# Altium schematic sheet 11.SchDoc
size 420 x 297 mm
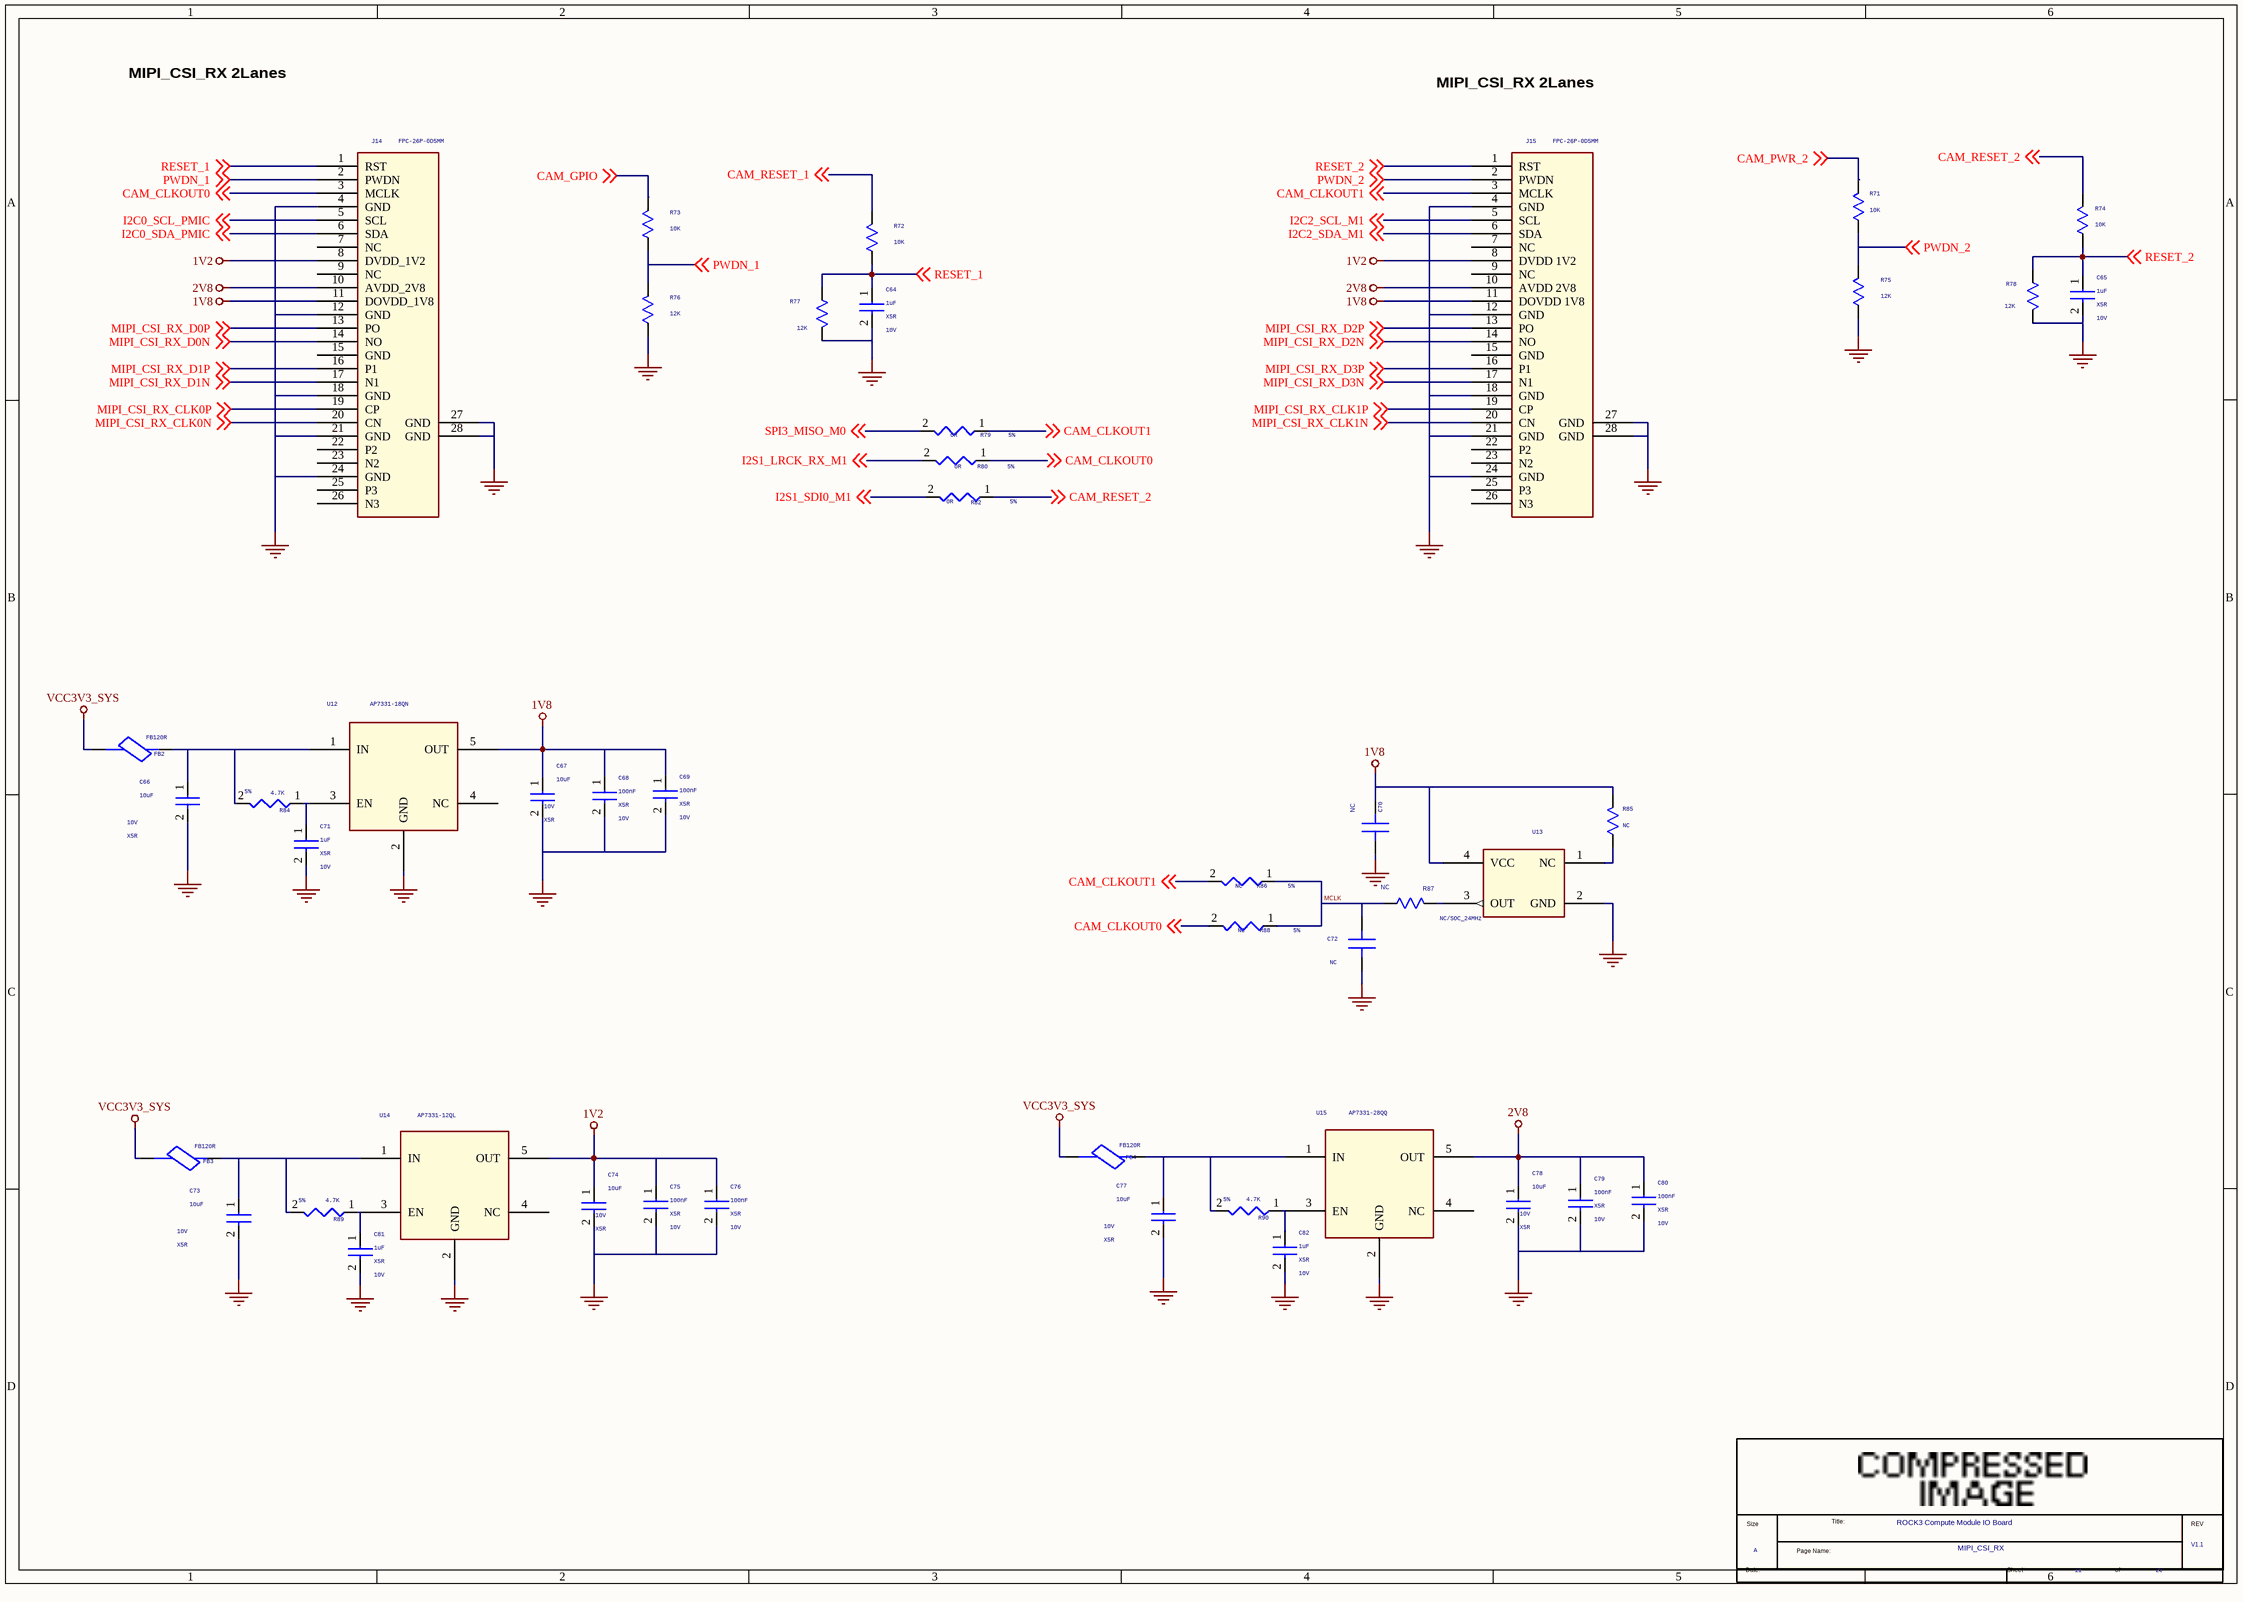
[diagram p0: 11.SchDoc]

## Parts
*  Page Count: 20  Page Number: 11  Page Size: A  Title: ROCK3 Compute Module IO Board  RevCode: V1.1  Doc: MIPI_CSI_RX  (hidden comment: radxa_gong)  (graphical)
C64  1uF  Voltage: 10V  Dielectric: X5R  [C0402]
C65  1uF  Voltage: 10V  Dielectric: X5R  [C0402]
C66  10uF  Voltage: 10V  Dielectric: X5R  [C0603]
C67  10uF  Voltage: 10V  Dielectric: X5R  [C0603]
C68  100nF  Voltage: 10V  Dielectric: X5R  [C0402]
C69  100nF  Voltage: 10V  Dielectric: X5R  [C0402]
C70  NC  [C0402]
C71  1uF  Voltage: 10V  Dielectric: X5R  [C0402]
C72  NC  [C0402]
C73  10uF  Voltage: 10V  Dielectric: X5R  [C0603]
C74  10uF  Voltage: 10V  Dielectric: X5R  [C0603]
C75  100nF  Voltage: 10V  Dielectric: X5R  [C0402]
C76  100nF  Voltage: 10V  Dielectric: X5R  [C0402]
C77  10uF  Voltage: 10V  Dielectric: X5R  [C0603]
C78  10uF  Voltage: 10V  Dielectric: X5R  [C0603]
C79  100nF  Voltage: 10V  Dielectric: X5R  [C0402]
C80  100nF  Voltage: 10V  Dielectric: X5R  [C0402]
C81  1uF  Voltage: 10V  Dielectric: X5R  [C0402]
C82  1uF  Voltage: 10V  Dielectric: X5R  [C0402]
FB2  FB120R  [R0402]
FB3  FB120R  [R0402]
FB4  FB120R  [R0402]
J14  FPC-26P-0D5MM  [com40pin_0_5]
J15  FPC-26P-0D5MM  [com40pin_0_5]
R71  10K  [R0402]
R72  10K  [R0402]
R73  10K  [R0402]
R74  10K  [R0402]
R75  12K  [R0402]
R76  12K  [R0402]
R77  12K  [R0402]
R78  12K  [R0402]
R79  0R  Tolerance: 5%  [R0402]
R80  0R  Tolerance: 5%  [R0402]
R82  0R  Tolerance: 5%  [R0402]
R84  4.7K  Tolerance: 5%  [R0402]
R85  NC  [R0402]
R86  NC  Tolerance: 5%  [R0402]
R87  NC  [R0402]
R88  NC  Tolerance: 5%  [R0402]
R89  4.7K  Tolerance: 5%  [R0402]
R90  4.7K  Tolerance: 5%  [R0402]
U12  AP7331-18QN  [SOT25]
U13  NC/SOC_24MHz  [CRY4_3R20X2R50X0R80]
U14  AP7331-12QL  [SOT25]
U15  AP7331-28QQ  [SOT25]

## Nets
1V2: C74.1 C75.1 C76.1 J14.8(DVDD_1V2) J15.8(DVDD_1V2) U14.5(OUT)
1V8: C67.1 C68.1 C69.1 C70.1 J14.11(DOVDD_1V8) J15.11(DOVDD_1V8) R85.2 U12.5(OUT) U13.4(VCC)
2V8: C78.1 C79.1 C80.1 J14.10(AVDD_2V8) J15.10(AVDD_2V8) U15.5(OUT)
GND: C64.2 C65.2 C66.2 C67.2 C68.2 C69.2 C70.2 C71.2 C72.2 C73.2 C74.2 C75.2 C76.2 C77.2 C78.2 C79.2 C80.2 C81.2 C82.2 J14.4(GND) J14.12(GND) J14.18(GND) J14.21(GND) J14.24(GND) J14.27(GND) J14.28(GND) J15.4(GND) J15.12(GND) J15.18(GND) J15.21(GND) J15.24(GND) J15.27(GND) J15.28(GND) R75.1 R76.1 R77.1 R78.1 U12.2(GND) U13.2(GND) U14.2(GND) U15.2(GND)
VCC3V3_SYS: FB2.1 FB3.1 FB4.1
CAM_CLKOUT0: J14.3(MCLK) R80.1 R88.2 ; off-sheet CAM_CLKOUT0
CAM_CLKOUT1: J15.3(MCLK) R79.1 R86.2 ; off-sheet CAM_CLKOUT1
CAM_GPIO: R73.2 ; off-sheet CAM_GPIO
CAM_PWR_2: R71.2 ; off-sheet CAM_PWR_2
CAM_RESET_1: R72.2 ; off-sheet CAM_RESET_1
CAM_RESET_2: R74.2 R82.1 ; off-sheet CAM_RESET_2
I2C0_SCL_PMIC: J14.5(SCL) ; off-sheet I2C0_SCL_PMIC
I2C0_SDA_PMIC: J14.6(SDA) ; off-sheet I2C0_SDA_PMIC
I2C2_SCL_M1: J15.5(SCL) ; off-sheet I2C2_SCL_M1
I2C2_SDA_M1: J15.6(SDA) ; off-sheet I2C2_SDA_M1
I2S1_LRCK_RX_M1: R80.2 ; off-sheet I2S1_LRCK_RX_M1
I2S1_SDI0_M1: R82.2 ; off-sheet I2S1_SDI0_M1
MCLK: C72.1 R86.1 R87.2 R88.1
MIPI_CSI_RX_CLK0N: J14.20(CN) ; off-sheet MIPI_CSI_RX_CLK0N
MIPI_CSI_RX_CLK0P: J14.19(CP) ; off-sheet MIPI_CSI_RX_CLK0P
MIPI_CSI_RX_CLK1N: J15.20(CN) ; off-sheet MIPI_CSI_RX_CLK1N
MIPI_CSI_RX_CLK1P: J15.19(CP) ; off-sheet MIPI_CSI_RX_CLK1P
MIPI_CSI_RX_D0N: J14.14(NO) ; off-sheet MIPI_CSI_RX_D0N
MIPI_CSI_RX_D0P: J14.13(PO) ; off-sheet MIPI_CSI_RX_D0P
MIPI_CSI_RX_D1N: J14.17(N1) ; off-sheet MIPI_CSI_RX_D1N
MIPI_CSI_RX_D1P: J14.16(P1) ; off-sheet MIPI_CSI_RX_D1P
MIPI_CSI_RX_D2N: J15.14(NO) ; off-sheet MIPI_CSI_RX_D2N
MIPI_CSI_RX_D2P: J15.13(PO) ; off-sheet MIPI_CSI_RX_D2P
MIPI_CSI_RX_D3N: J15.17(N1) ; off-sheet MIPI_CSI_RX_D3N
MIPI_CSI_RX_D3P: J15.16(P1) ; off-sheet MIPI_CSI_RX_D3P
PWDN_1: J14.2(PWDN) R73.1 R76.2 ; off-sheet PWDN_1
PWDN_2: J15.2(PWDN) R71.1 R75.2 ; off-sheet PWDN_2
RESET_1: C64.1 J14.1(RST) R72.1 R77.2 ; off-sheet RESET_1
RESET_2: C65.1 J15.1(RST) R74.1 R78.2 ; off-sheet RESET_2
SPI3_MISO_M0: R79.2 ; off-sheet SPI3_MISO_M0
NetC66_1: C66.1 FB2.2 R84.2 U12.1(IN)
NetC71_1: C71.1 R84.1 U12.3(EN)
NetC73_1: C73.1 FB3.2 R89.2 U14.1(IN)
NetC77_1: C77.1 FB4.2 R90.2 U15.1(IN)
NetC81_1: C81.1 R89.1 U14.3(EN)
NetC82_1: C82.1 R90.1 U15.3(EN)
NetR85_1: R85.1 U13.1(NC)
NetR87_1: R87.1 U13.3(OUT)

Not connected (* = marked no-connect by the designer): J14 7(NC) 9(NC) 15(GND) 22(P2) 23(N2) 25(P3) 26(N3); J15 7(NC) 9(NC) 15(GND) 22(P2) 23(N2) 25(P3) 26(N3); U12 4(NC); U14 4(NC); U15 4(NC)

## Notes on the sheet
- MIPI_CSI_RX 2Lanes
- (in symbol radxa_gong) Size; Title:; REV; Page Name:; Date:; Sheet; of

## Library data of the parts
C64 C68 C69 C79 C80 = CAP NP_Dup2: cap,100.00nF,+/-10%,10V,X5R,C0402; Manufacturer: TDK; RK PN: C1005X5R1A104K050BA; Priority: A; Tolerance: 10%; Part Type: C0402; Manufacturer PN: C1005X5R1A104K050BA; Created by: JJJ
C65 C71 C75 C76 C81 C82 = CAP NP_Dup2: cap,100.00nF,+/-10%,10V,X5R,C0402; Manufacturer PN: C1005X5R1A104K050BA; Manufacturer: TDK; Tolerance: 10%; Priority: A; Created by: JJJ; Part Type: C0402; RK PN: C1005X5R1A104K050BA
C66 C73 C74 C77 C78 = CAP NP_Dup2: cap,10.00uF,+/-10%,10V,X5R,C0603; Manufacturer: TDK; RK PN: C1608X5R1A106K080AC; Priority: A; Tolerance: 10%; Part Type: C0603; Manufacturer PN: C1608X5R1A106K080AC; Created by: JJJ
C67 = CAP NP_Dup2: cap,10.00uF,+/-10%,10V,X5R,C0603; Manufacturer PN: C1608X5R1A106K080AC; Manufacturer: TDK; Tolerance: 10%; Priority: A; Created by: JJJ; Part Type: C0603; RK PN: C1608X5R1A106K080AC
C70 = C: 贴片陶瓷电容 0402 X5R 1uF±10% 16V; PARTS: 1; Part Number: 823030105005; OriginalSymbolOrigin: (0,30); PKG_TYPE: CAP2-100-250; LEVEL: STD; PINSWAP: (A,B); Approved: 已承认; Grade: B; ROOM: DVDD_MEDIA; Part Type: 电容
C72 = C: 贴片陶瓷电容 0402 NPO 10pF±5% 50V; PARTS: 1; Part Number: 823060100001; OriginalSymbolOrigin: (0,30); PKG_TYPE: CAP2-100-250; LEVEL: STD; PINSWAP: (A,B); ROOM: AN41908; Grade: B; Approved: 已承认; Part Type: 电容
FB2 = FB: 贴片磁珠 0603 600Ω±25% 1000mA 铁氧体叠片 UPZ1608E601-1R0T 顺络; Part Number: 832026000003; Approved: 已承认; Grade: D; Part Type: 磁珠
FB3 FB4 = FB: 贴片磁珠 0603 600Ω±25% 1000mA 铁氧体叠片 UPZ1608E601-1R0T 顺络; Part Number: 832026000003; Grade: D; Approved: 已承认; Part Type: 磁珠
J14 = com40pin_0_2
J15 = com40pin_0_1
R71 R74 R75 R77 R85 = R: 贴片电阻 0805 0Ω±5%; PARTS: 1; Part Number: 811040000001; LEVEL: STD; PKG_TYPE: 2; PINSWAP: (A,B); OriginalSymbolOrigin: (10,20); Approved: 已承认; Grade: B; ROOM: DC-IRIS; Part Type: 电阻
R72 R73 R76 R78 = R: 贴片电阻 0805 0Ω±5%; PARTS: 1; Part Number: 811040000001; LEVEL: STD; PKG_TYPE: 2; PINSWAP: (A,B); OriginalSymbolOrigin: (10,20); ROOM: DC-IRIS; Grade: B; Approved: 已承认; Part Type: 电阻
R79 R82 R88-R90 = RESISTOR_Dup1: 通用厚膜电阻,100R,+/-5%,R0402,1/16W.; Manufacturer: YAGEO; RK PN: RC0402JR-07100RL; Priority: A; Wattage: 1/16W; Part Type: 通用厚膜电阻; Manufacturer PN: RC0402JR-07100RL; Created by: YTL
R80 R84 R86 = RESISTOR_Dup1: 通用厚膜电阻,100R,+/-5%,R0402,1/16W.; Manufacturer PN: RC0402JR-07100RL; Manufacturer: YAGEO; Wattage: 1/16W; Priority: A; Created by: YTL; Part Type: 通用厚膜电阻; RK PN: RC0402JR-07100RL
R87 = R: 贴片电阻 0402 33Ω±5%; PARTS: 1; Part Number: 811020330001; LEVEL: STD; PKG_TYPE: 2; PINSWAP: (A,B); OriginalSymbolOrigin: (10,20); Approved: 已承认; Grade: B; ROOM: AN41908; Part Type: 电阻
U12 U14 U15 = AP7331-18WG
U13 = OSC_4PIN_1: 贴片钟振 27.000MHz ±30PPM  3.3V 3.2x2.5mm; Part Number: 841042700403; Grade: B; Approved: 已承认; ROOM: AN41908; Part Type: 钟振
* = radxa_gong: Page Create Date: March  8, 1995